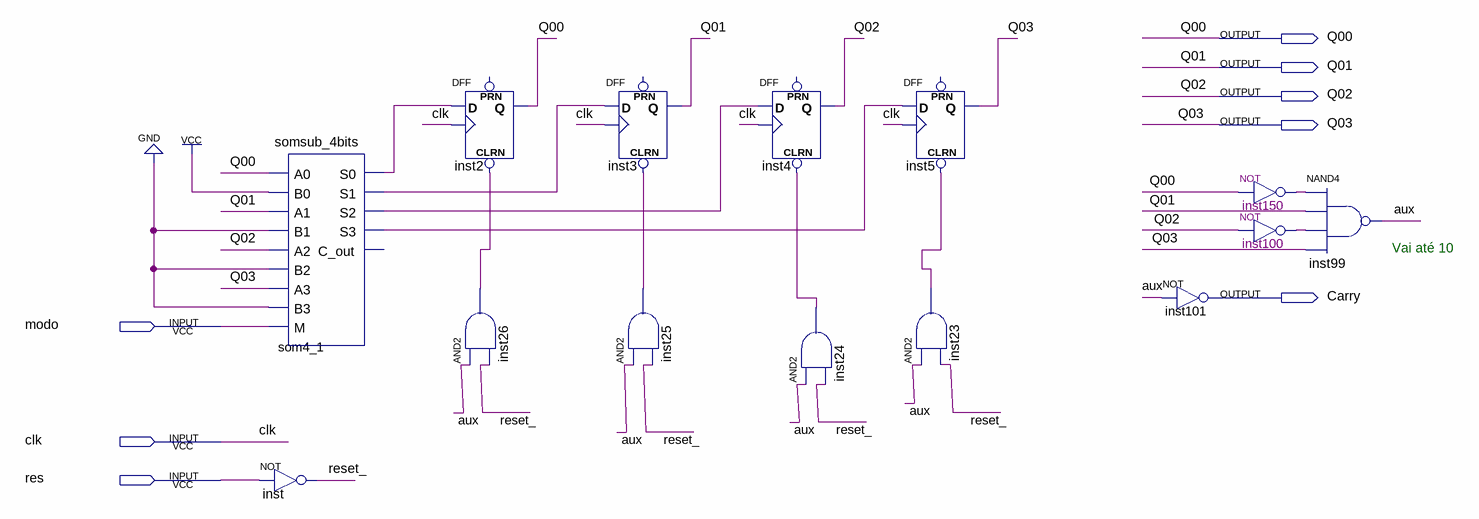
[diagram p0: schematic sheet]
// Quartus schematic limitador.bdf as structural Verilog: 14 symbols, 8 pins
module limitador (
  input  modo,
  input  clk,
  input  res,
  output Q00,
  output Q01,
  output Q02,
  output Q03,
  output Carry
);

  wire aux, inst23_out, inst24_out, inst25_out, inst26_out, inst100_out, inst150_out, reset_, som4_1_s0,
       som4_1_s1, som4_1_s2, som4_1_s3;

  not inst (reset_, res);
  somsub_4bits som4_1 (
    .A0(Q00), .B0(1'b1), .A1(Q01), .B1(1'b0), .A2(Q02), .B2(1'b0), .A3(Q03), .B3(1'b0), .M(modo),
    .S0(som4_1_s0), .S1(som4_1_s1), .S2(som4_1_s2), .S3(som4_1_s3));  // open: C_out
  DFF inst2 (.CLRN(inst26_out), .CLK(clk), .D(som4_1_s0), .Q(Q00));  // open: PRN
  and inst26 (inst26_out, aux, reset_);
  DFF inst3 (.CLRN(inst25_out), .CLK(clk), .D(som4_1_s1), .Q(Q01));  // open: PRN
  and inst25 (inst25_out, aux, reset_);
  DFF inst4 (.CLRN(inst24_out), .CLK(clk), .D(som4_1_s2), .Q(Q02));  // open: PRN
  and inst24 (inst24_out, aux, reset_);
  DFF inst5 (.CLRN(inst23_out), .CLK(clk), .D(som4_1_s3), .Q(Q03));  // open: PRN
  and inst23 (inst23_out, aux, reset_);
  not inst101 (Carry, aux);
  not inst150 (inst150_out, Q00);
  not inst100 (inst100_out, Q02);
  nand inst99 (aux, inst150_out, Q01, inst100_out, Q03);

  // Notes on the sheet:
  //   Vai até 10
endmodule
